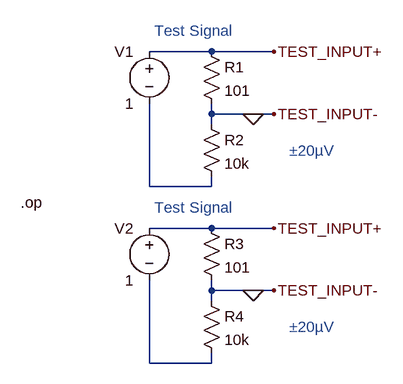
[diagram p0: schematic capstone_all.asc]
capstone_all.asc, the LTspice schematic file:
Version 4
SHEET 1 880 680
WIRE -48 80 -144 80
WIRE 48 80 -48 80
WIRE -48 176 -48 160
WIRE 16 176 -48 176
WIRE 48 176 16 176
WIRE -48 192 -48 176
WIRE -144 288 -144 160
WIRE -48 288 -48 272
WIRE -48 288 -144 288
WIRE -48 352 -144 352
WIRE 48 352 -48 352
WIRE -48 448 -48 432
WIRE 16 448 -48 448
WIRE 48 448 16 448
WIRE -48 464 -48 448
WIRE -144 560 -144 432
WIRE -48 560 -48 544
WIRE -48 560 -144 560
FLAG 48 176 TEST_INPUT-
FLAG 48 80 TEST_INPUT+
FLAG 16 176 0
FLAG 48 448 TEST_INPUT-
FLAG 48 352 TEST_INPUT+
FLAG 16 448 0
SYMBOL res -64 64 R0
SYMATTR InstName R1
SYMATTR Value 101
SYMBOL res -64 176 R0
SYMATTR InstName R2
SYMATTR Value 10k
SYMBOL voltage -144 64 M0
WINDOW 123 0 0 Left 0
WINDOW 39 0 0 Left 0
SYMATTR InstName V1
SYMATTR Value 1
SYMBOL res -64 336 R0
SYMATTR InstName R3
SYMATTR Value 101
SYMBOL res -64 448 R0
SYMATTR InstName R4
SYMATTR Value 10k
SYMBOL voltage -144 336 M0
WINDOW 123 0 0 Left 0
WINDOW 39 0 0 Left 0
SYMATTR InstName V2
SYMATTR Value 1
TEXT -136 48 Left 2 ;Test Signal
TEXT 72 232 Left 2 ;±20µV
TEXT -342 312 Left 2 !.op
TEXT -136 320 Left 2 ;Test Signal
TEXT 72 504 Left 2 ;±20µV

The netlist it stands for:
* capstone_all.asc
R1 TEST_INPUT+ 0 101
R2 0 N001 10k
V1 TEST_INPUT+ N001 1
R3 TEST_INPUT+ 0 101
R4 0 N002 10k
V2 TEST_INPUT+ N002 1
* Test Signal
* ±20µV
.op
* Test Signal
* ±20µV
.backanno
.end